# Altium schematic sheet 2_EVB-A32S1-M_MCU.SchDoc
size A4; SheetNumber: 2; SheetTotal: 4
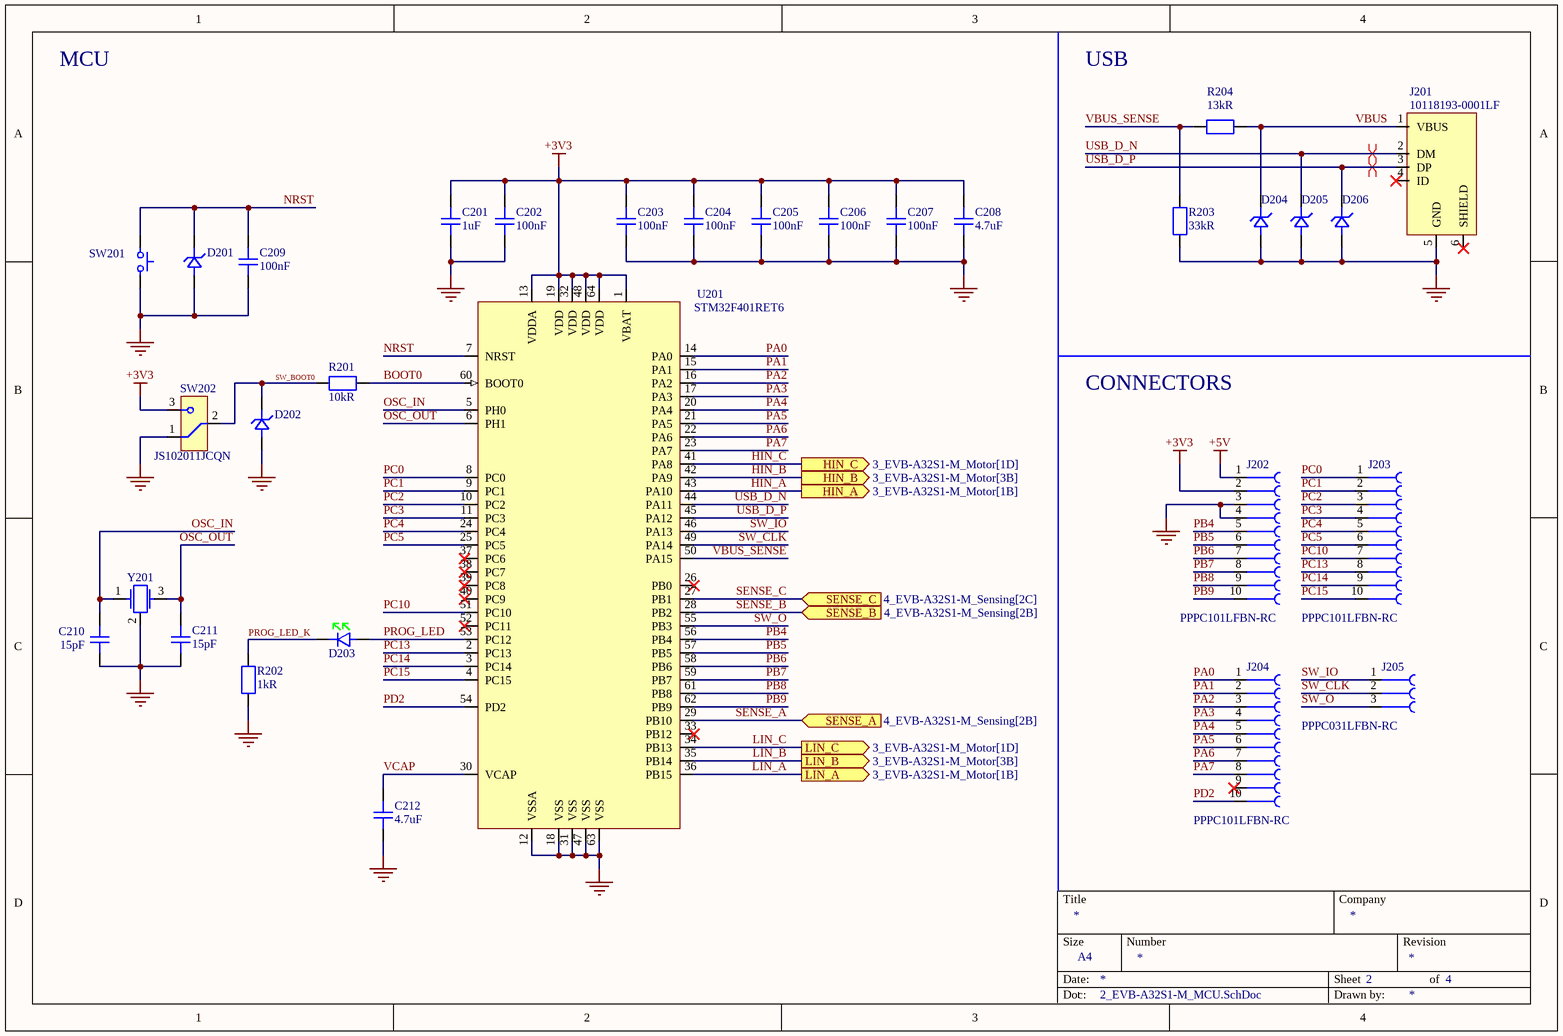
[diagram p0: 2_EVB-A32S1-M_MCU.SchDoc]

## Parts
C201  value 1uF  [C_Yageo_CC_0603_A]  (hidden comment: CC0603KRX7R7BB105)
C202  value 100nF  [C_Samsung_CL_0402_A]  (hidden comment: CL05B104KP5NNNC)
C203  value 100nF  [C_Samsung_CL_0402_A]  (hidden comment: CL05B104KP5NNNC)
C204  value 100nF  [C_Samsung_CL_0402_A]  (hidden comment: CL05B104KP5NNNC)
C205  value 100nF  [C_Samsung_CL_0402_A]  (hidden comment: CL05B104KP5NNNC)
C206  value 100nF  [C_Samsung_CL_0402_A]  (hidden comment: CL05B104KP5NNNC)
C207  value 100nF  [C_Samsung_CL_0402_A]  (hidden comment: CL05B104KP5NNNC)
C208  value 4.7uF  [C_Samsung_CL_0402_A]  (hidden comment: CL05A475MP5NRNC)
C209  value 100nF  [C_Samsung_CL_0402_A]  (hidden comment: CL05B104KP5NNNC)
C210  value 15pF  [C_Yageo_CC_0402_A]  (hidden comment: CC0402JRNPO9BN150)
C211  value 15pF  [C_Yageo_CC_0402_A]  (hidden comment: CC0402JRNPO9BN150)
C212  value 4.7uF  [C_Samsung_CL_0402_A]  (hidden comment: CL05A475MP5NRNC)
D201  D5V0F1U2S9-7  [D_TVS_Uni_Diodes_SOD-923_B]  (value not drawn)
D202  D5V0F1U2S9-7  [D_TVS_Uni_Diodes_SOD-923_B]  (value not drawn)
D203  LTST-C190GKT  [D_LED_Lite-On_Green_0603_A]  (value not drawn)
D204  D5V0F1U2S9-7  [D_TVS_Uni_Diodes_SOD-923_B]  (value not drawn)
D205  D5V0F1U2S9-7  [D_TVS_Uni_Diodes_SOD-923_B]  (value not drawn)
D206  D5V0F1U2S9-7  [D_TVS_Uni_Diodes_SOD-923_B]  (value not drawn)
J201  10118193-0001LF  [J_USB_Micro-B_Amphenol_10118193-0001LF]
J202  PPPC101LFBN-RC  [J_Sullins_01x10_Socket_2.54mm]
J203  PPPC101LFBN-RC  [J_Sullins_01x10_Socket_2.54mm]
J204  PPPC101LFBN-RC  [J_Sullins_01x10_Socket_2.54mm]
J205  PPPC031LFBN-RC  [J_Sullins_01x03_Socket_2.54mm]
R201  value 10kR  [R_Yageo_RCL_0402_A]  (hidden comment: RC0402FR-0710KL)
R202  value 1kR  [R_Yageo_RCL_0402_A]  (hidden comment: RC0402FR-071KL)
R203  value 33kR  [R_Yageo_RCL_0402_A]  (hidden comment: RC0402FR-0733KL)
R204  value 13kR  [R_Yageo_RCL_0402_A]  (hidden comment: RC0402FR-0713KL)
SW201  PTS647SN50SMTR2LFS  [SW_Tactitle_SPST_C&K_PTS647SN50SMTR2LFS]  (value not drawn)
SW202  JS102011JCQN  [SW_Slide_C&K_JS102011JCQN]
U201  STM32F401RET6  [U_ST_LQFP64_B]
Y201  ECS-240-12-37B-CKY-TR  [Y_Crystal_GND24_ECS_240-12-37B-CKY-TR]  (value not drawn)

## Ports
HIN_A (out, see 3_EVB-A32S1-M_Motor[1B]), HIN_B (out, see 3_EVB-A32S1-M_Motor[3B]), HIN_C (out, see 3_EVB-A32S1-M_Motor[1D]), LIN_A (out, see 3_EVB-A32S1-M_Motor[1B]), LIN_B (out, see 3_EVB-A32S1-M_Motor[3B]), LIN_C (out, see 3_EVB-A32S1-M_Motor[1D]), SENSE_A (in, see 4_EVB-A32S1-M_Sensing[2B]), SENSE_B (in, see 4_EVB-A32S1-M_Sensing[2B]), SENSE_C (in, see 4_EVB-A32S1-M_Sensing[2C])

## Nets
+3V3: C201.2 C202.2 C203.2 C204.2 C205.2 C206.2 C207.2 C208.2 J202.2 SW202.3 U201.1(VBAT) U201.13(VDDA) U201.19(VDD) U201.32(VDD) U201.48(VDD) U201.64(VDD)
+5V: J202.1
GND: C201.1 C202.1 C203.1 C204.1 C205.1 C206.1 C207.1 C208.1 C209.1 C210.1 C211.1 C212.1 D201.2 D202.2 D204.2 D205.2 D206.2 J201.5(GND) J202.3 J202.4 R202.1 R203.1 SW201.2 SW202.1 U201.12(VSSA) U201.18(VSS) U201.31(VSS) U201.47(VSS) U201.63(VSS) Y201.2
BOOT0: R201.2 U201.60(BOOT0)
HIN_A: U201.43(PA10) ; port HIN_A
HIN_B: U201.42(PA9) ; port HIN_B
HIN_C: U201.41(PA8) ; port HIN_C
LIN_A: U201.36(PB15) ; port LIN_A
LIN_B: U201.35(PB14) ; port LIN_B
LIN_C: U201.34(PB13) ; port LIN_C
NRST: C209.2 D201.1 SW201.1 U201.7(NRST)
OSC_IN: C210.2 U201.5(PH0) Y201.1
OSC_OUT: C211.2 U201.6(PH1) Y201.3
PA0: J204.1 U201.14(PA0)
PA1: J204.2 U201.15(PA1)
PA2: J204.3 U201.16(PA2)
PA3: J204.4 U201.17(PA3)
PA4: J204.5 U201.20(PA4)
PA5: J204.6 U201.21(PA5)
PA6: J204.7 U201.22(PA6)
PA7: J204.8 U201.23(PA7)
PB4: J202.5 U201.56(PB4)
PB5: J202.6 U201.57(PB5)
PB6: J202.7 U201.58(PB6)
PB7: J202.8 U201.59(PB7)
PB8: J202.9 U201.61(PB8)
PB9: J202.10 U201.62(PB9)
PC0: J203.1 U201.8(PC0)
PC1: J203.2 U201.9(PC1)
PC2: J203.3 U201.10(PC2)
PC3: J203.4 U201.11(PC3)
PC4: J203.5 U201.24(PC4)
PC5: J203.6 U201.25(PC5)
PC10: J203.7 U201.51(PC10)
PC13: J203.8 U201.2(PC13)
PC14: J203.9 U201.3(PC14)
PC15: J203.10 U201.4(PC15)
PD2: J204.10 U201.54(PD2)
PROG_LED: D203.2 U201.53(PC12)
PROG_LED_K: D203.1 R202.2
SENSE_A: U201.29(PB10) ; port SENSE_A
SENSE_B: U201.28(PB2) ; port SENSE_B
SENSE_C: U201.27(PB1) ; port SENSE_C
SW_BOOT0: D202.1 R201.1 SW202.2
SW_CLK: J205.2 U201.49(PA14)
SW_IO: J205.1 U201.46(PA13)
SW_O: J205.3 U201.55(PB3)
USB_D_N: D205.1 J201.2(DM) U201.44(PA11)
USB_D_P: D206.1 J201.3(DP) U201.45(PA12)
VBUS: D204.1 J201.1(VBUS) R204.2
VBUS_SENSE: R203.2 R204.1 U201.50(PA15)
VCAP: C212.2 U201.30(VCAP)

Not connected (* = marked no-connect by the designer): J201 4(ID)* 6(SHIELD)*; J204 9*; U201 26(PB0)* 33(PB12)* 37(PC6)* 38(PC7)* 39(PC8)* 40(PC9)* 52(PC11)*

## Layout directives
differential pair; differential pair class DIFF_USB: USB_D_N, USB_D_P

## Notes on the sheet
- MCU
- USB
- CONNECTORS
- Title
- Company
- Size
- Date:
- A4
- Number
- Sheet
- Revision
- of
- Doc:
- Drawn by:

## Library data of the parts
C201 = CMP-001-00019-5: Multilayer Ceramic Capacitor, 1 uF, 16 V, ± 10%, X7R, 0603 [1608 Metric]; Voltage: 16V; Dissipation Factor: 5%; Case Code (Imperial): 0603; ComponentLink1URL: https://www.yageo.com/upload/media/product/productsearch/datasheet/mlcc/UPY-GPHC_X7R_6.3V-to-250V_24.pdf; Pins: 2; Width: 0.031inch; Tolerance: 10%; Height: 0.8mm; Radiation Hardening: No; Lead Free: Lead Free; Material: Ceramic; Reach SVHC Compliant: Unknown; Case Code (Metric): 1608; Min Operating Temperature: -55°C; Case/Package: 0603; Package Quantity: 1; Thickness: 0.035inch; Packaging: Tape and Reel; Series: CC; Termination: SMD/SMT; Max Operating Temperature: 125°C; Construction: Flat; Depth: 0.8mm; Halogen Free: Halogen Free; RoHS Compliant: Yes; Voltage Rating (DC): 16V; Dielectric: X7R; Length: 1.6mm; Voltage Rating: 16V; Mounting Technology: Surface Mount; ComponentLink1Description: Datasheet
C202-C207 C209 = CMP-001-00023-3: Multilayer Ceramic Capacitor, 0.1 uF, 10 V, ± 10%, X7R, 0402 [1005 Metric]; Voltage Rating: 10V; Dielectric: X7R; Height: 0.5mm; Tolerance: 10%; Voltage Rating (DC): 10V; Case/Package: 0402; RoHS Compliant: Yes; Packaging: Tape and Reel; Case Code (Imperial): 0402; Material: Ceramic; Case Code (Metric): 1005; Max Operating Temperature: 125°C; Mounting Technology: Surface Mount; Min Operating Temperature: -55°C; Series: CL; Construction: Flat; Depth: 0.5mm; Length: 1mm; Package Quantity: 1; Radiation Hardening: No; Thickness: 0.022inch; Width: 0.02inch
C208 C212 = CMP-001-00024-3: Multilayer Ceramic Capacitor, 4.7 uF, 10 V, ± 20%, X5R, 0402 [1005 Metric]; Voltage Rating: 10V; Packaging: Cut Tape; Tolerance: 20%; Case Code (Metric): 1005; ComponentLink1Description: Datasheet; Mounting Technology: Surface Mount; ComponentLink1URL: https://mm.digikey.com/Volume0/opasdata/d220001/medias/docus/863/CL05A475MP5NRNC_Spec.pdf; Lead Free: Lead Free; Series: CL; Min Operating Temperature: -55°C; Material: Ceramic; Case Code (Imperial): 0402; Max Operating Temperature: 85°C; Dielectric: X5R; RoHS Compliant: Yes; Case/Package: 0402; Height: 550um
C210 C211 = CMP-001-00017-14: Multilayer Ceramic Capacitor, 15 pF, 10 V, ± 5%, X7R, 0402 [1005 Metric]; Insulation Resistance: 100GR; Dielectric: C0G; Voltage Rating (DC): 50V; Temperature Coefficient: 30ppm/°C; ComponentLink1URL: https://www.yageo.com/upload/media/product/productsearch/datasheet/mlcc/UPY-GP_NP0_16V-to-50V_18.pdf; Length: 1mm; Thickness: 0.022inch; Packaging: Tape and Reel; RoHS Compliant: Yes; Height: 0.5mm; Max Operating Temperature: 125°C; Depth: 0.5mm; Radiation Hardening: No; Termination: SMD/SMT; Width: 0.02inch; Series: CC; Tolerance: 5%; Lead Free: Lead Free; ComponentLink1Description: Datasheet; Package Quantity: 1; Min Operating Temperature: -55°C; Voltage: 50V; Case/Package: 0402; Reach SVHC Compliant: No; Case Code (Metric): 1005; Case Code (Imperial): 0402; Voltage Rating (AC): 50V; Mounting Technology: Surface Mount; Halogen Free: Halogen Free; Dielectric Material: Ceramic; Pins: 2; Voltage Rating: 50V; Material: Ceramic
D201 D202 D204-D206 = CMP-004-00007-2: Diode TVS Dual Uni-Dir 5.5V 250000W 2-Pin SOD-923 T/R; Max Power Dissipation: 250mW; ESD Protection: Yes; Max Reverse Leakage Current: 100nA; Max Surge Current: 1.5A; Diode Type: ZENER; Direction: Unidirectional; Breakdown Voltage: 6V; Clamping Voltage: 10V; Value: 5E-13F; Peak Pulse Power: 250kW; Number of Unidirectional Channels: 1; ComponentLink1Description: Datasheet; Working Voltage: 5.5V; Reverse Standoff Voltage: 5.5V; Case/Package: SOD-923-2; Max Operating Temperature: 150°C; Power Line Protection: Yes; Mounting Technology: Surface Mount; Peak Pulse Current: 1.5A; Packaging: Tape and Reel; RoHS Compliant: Yes; Package Quantity: 10000; Contact Plating: Tin,Matte; Series: -; Termination: SMD/SMT; Polarity: Unidirectional; Min Breakdown Voltage: 6V; Min Operating Temperature: -65°C; ComponentLink1URL: https://www.diodes.com/assets/Datasheets/D5V0F1U2S9.pdf
D203 = CMP-007-00001-3: LED Uni-Color Green 565nm 2-Pin Chip LED T/R; Viewing Angle: 130°; Lens Transparency: Clear; Reverse Voltage: 5V; Lens Size: 0.8mm; Lens Color: Colorless; Lens Style: Flat,Diffused,Colorless,Rectangular,Clear; Power Dissipation: 100mW; Forward Voltage: 2.1V; Dominant Wavelength: 569nm; Test Current: 10mA; Forward Current: 30mA; Luminous Intensity: 6mcd; Number of Elements: 1; Voltage: 2V; Series: -; ComponentLink1URL: https://mm.digikey.com/Volume0/opasdata/d220001/medias/docus/858/LTST-C190GKT.pdf; Packaging: Tape and Reel; Package Quantity: 1; Case Code (Imperial): 0603; Height: 0.9mm; ComponentLink1Description: Datasheet; Color: Green; Case Code (Metric): 1608; Min Operating Temperature: -55°C; Wavelength: 565nm; Length: 1.6mm; Max Operating Temperature: 85°C; Case/Package: 0603; RoHS Compliant: Yes; Mounting Technology: Surface Mount; Width: 0.8mm; Depth: 0.8mm; Illumination Color: Green; Lead Free: Lead Free; Number of LEDs: 1; Pins: 2; Power Rating: 100mW; Radiation Hardening: No
J201 = CMP-002-00002-12: Usb Connector, 5 Contact(S), Female, Right Angle, Surface Mount Terminal, Locking, Receptacle; Number of Contacts: 5; Current Rating: 1.8A; Connector Type: USB,Receptacle; Pitch: 650um; Number of Ports: 1; Voltage Rating: 100V; USB Standard: USB 2.0; Insulation Resistance: 1GR; Pins: 11; Termination: Solder; Height: 3mm; Packaging: Tape and Reel; Max Operating Temperature: 85°C; Radiation Hardening: No; Features: Shielded; Contact Material: Nickel,Gold; Series: -; Orientation: Right Angle; Min Operating Temperature: -55°C; ComponentLink2URL: https://cdn.amphenol-cs.com/media/wysiwyg/files/documentation/datasheet/inputoutput/io_usb_micro.pdf; Color: Black; Housing Material: Polymer; Mounting Technology: Surface Mount,Horizontal; ComponentLink1Description: Drawing; Depth: 5.67mm; Package Quantity: 1200; ComponentLink1URL: https://cdn.amphenol-cs.com/media/wysiwyg/files/drawing/10118193.pdf; ComponentLink2Description: Datasheet; Flammability Rating: UL94 V-0; Length: 7.86mm; Gender: Female; Contact Plating: Gold; Max Voltage Rating (AC): 100V
J202-J204 = CMP-002-00003-9: 10 Position Total Single Row 2.54 mm Pitch Straight Female Header; Voltage Rating: 250V; Number of Contacts: 10; Pitch: 0.1inch; Current Rating: 3A; Connector Type: Header; Number of Rows: 1; Package Quantity: 1000; Contact Type: Female Socket; Color: Black; Min Operating Temperature: -40°C; RoHS Compliant: Yes; Length: 25.9mm; ComponentLink1URL: https://mm.digikey.com/Volume0/opasdata/d220001/medias/docus/937/Female_Headers.100_DS.pdf; ComponentLink1Description: Datasheet; Height: 8.5mm; Contact Plating: Gold; Width: 2.5mm; Packaging: Bulk; Mounting Technology: Through Hole; Contact Material: Bronze,Nickel,Gold; Lead Free: Lead Free; Termination: Solder; Housing Material: Plastic; Number of Positions: 10; Max Operating Temperature: 105°C
J205 = CMP-002-00004-17: 3 Position Total Single Row 2.54 mm Pitch Straight Female Header; Voltage Rating: 250V; Number of Positions: 3; Pitch: 2.54mm; Series: -; Length: 8.12mm; Connector Type: Header; Insulation Color: Black; Insulation Material: Polyester; Height: 8.5mm; ComponentLink1Description: Datasheet; Termination: Solder; Contact Shape: Square; Width: 2.5mm; Fastening Type: Pull; RoHS Compliant: Yes; Contact Finish - Mating: GOLD; Number of Rows: 1; Min Operating Temperature: -40°C; Max Operating Temperature: 105°C; Flammability Rating: UL94 V-0; Contact Material: Bronze; Packaging: Tray; Contact Type: Female Socket; Lead Free: Lead Free; Mounting Technology: Through Hole; ComponentLink1URL: https://mm.digikey.com/Volume0/opasdata/d220001/medias/docus/937/Female_Headers.100_DS.pdf; Housing Material: Plastic
R201 = CMP-009-00003-11: SMD Chip Resistor, 10 kOhm, ± 1%, 62.5 mW, 0402 [1005 Metric], Thick Film, General Purpose; Power Rating: 62.5mW; Max Power Dissipation: 63mW; Temperature Coefficient: 100ppm/°C; Voltage Rating (DC): 50V; Number of Terminations: 2; Width: 0.5mm; Resistance Tolerance: 1%; Length: 1mm; Lead Pitch: 0.2mm; Case Code (Metric): 1005; Case Code (Imperial): 0402; Construction: Rectangular; Tolerance: 1%; ComponentLink1URL: https://www.yageo.com/upload/media/product/products/datasheet/rchip/PYu-RC_Group_51_RoHS_L_12.pdf; Max Operating Temperature: 155°C; Series: RC; Military Standard: Not; Depth: 0.5mm; ComponentLink1Description: Datasheet; Features: Moisture Resistant; Termination: SMD/SMT; Pins: 2; Lead Free: Lead Free; Min Operating Temperature: -55°C; Resistor Type: Thick Film; Voltage Rating: 50V; Case/Package: 0402; Packaging: Tape and Reel; RoHS Compliant: Yes; Reach SVHC Compliant: Unknown
R202 = CMP-009-00002-11: SMD Chip Resistor, 1 kOhm, ± 1%, 62.5 mW, 0402 [1005 Metric], Thick Film, General Purpose; Temperature Coefficient: 100ppm/°C; Max Power Dissipation: 63mW; Voltage Rating (AC): 50V; Power Rating: 62.5mW; Min Operating Temperature: -55°C; Case Code (Metric): 1005; Number of Terminations: 2; Case Code (Imperial): 0402; Pins: 2; Depth: 0.5mm; Construction: Rectangular; Voltage Rating: 50V; RoHS Compliant: Yes; Series: RC; Resistor Type: Thick Film; Length: 1mm; Voltage Rating (DC): 50V; Case/Package: 0402; Features: Moisture Resistant; Reach SVHC Compliant: No; Lead Free: Lead Free; Termination: SMD/SMT; Height: 0.32mm; Tolerance: 1%; ComponentLink1Description: Datasheet; Packaging: Tape and Reel; Width: 0.5mm; Resistance Tolerance: 1%; Military Standard: Not; ComponentLink1URL: https://www.yageo.com/upload/media/product/products/datasheet/rchip/PYu-RC_Group_51_RoHS_L_12.pdf; Max Operating Temperature: 155°C; Technology: THICK FILM
R203 = CMP-009-00005-12: SMD Chip Resistor, 33 kOhm, ± 1%, 63 mW, 0402 [1005 Metric], Thick Film, General Purpose; Power Rating: 63mW; Temperature Coefficient: 100ppm/°C; Voltage Rating (AC): 50V; Tolerance: 1%; Military Standard: Not; Features: Moisture Resistant; RoHS Compliant: Yes; Construction: Rectangular; Number of Terminations: 2; Min Operating Temperature: -55°C; Case Code (Metric): 1005; Resistor Type: Thick Film; Max Power Dissipation: 63mW; Voltage Rating (DC): 50V; Pins: 2; Series: RC; Termination: SMD/SMT; ComponentLink1Description: Datasheet; Max Operating Temperature: 155°C; Case/Package: 0402; Reach SVHC Compliant: No; Case Code (Imperial): 0402; Height: 0.016inch; Depth: 0.5mm; Length: 1mm; Package Quantity: 1; Lead Free: Lead Free; Resistance Tolerance: 1%; Weight: 2.3E-05oz; Width: 0.5mm; Packaging: Tape and Reel; Voltage Rating: 50V; ComponentLink1URL: https://www.yageo.com/upload/media/product/products/datasheet/rchip/PYu-RC_Group_51_RoHS_L_12.pdf
R204 = CMP-009-00001-11: SMD Chip Resistor, 13 kOhm, ± 1%, 63 mW, 0402 [1005 Metric], Thick Film, General Purpose; Voltage Rating (DC): 50V; Temperature Coefficient: 100ppm/°C; Max Power Dissipation: 63mW; Power Rating: 62.5mW; Package Quantity: 10000; Packaging: Tape and Reel; Max Operating Temperature: 155°C; Termination: SMD/SMT; Mounting Technology: Surface Mount; Min Operating Temperature: -55°C; Series: RC; Width: 0.02inch; Lead Free: Lead Free; Case Code (Metric): 1005; Tolerance: 1%; Working Voltage: 50V; Voltage Rating: 50V; ComponentLink1URL: https://www.yageo.com/upload/media/product/products/datasheet/rchip/PYu-RC_Group_51_RoHS_L_12.pdf; Case/Package: 0402; Length: 0.039inch; Height: 0.016inch; ComponentLink1Description: Datasheet; Technology: THICK FILM; Depth: 0.5mm; RoHS Compliant: Yes; Features: Moisture Resistant; Case Code (Imperial): 0402; Number of Terminations: 2
SW201 = CMP-011-00000-13: Switch Tactile N.O. SPST Round Button Gull Wing 0.05A 12VDC 100000Cycles 0.98N SMD T/R; pin to pad: 1>1+2 2>3+4; Ratings: IP40; Switch Function: Off-Mom; Illumination Type: Non-Illuminated; Actuator Type: Standard; Number of Positions: 2; Operating Force: 100gf; Switch Travel: 0.25mm; ComponentLink1URL: https://www.ckswitches.com/media/2567/pts647.pdf; Series: PTS647; Throw Configuration: SPST; Max Operating Temperature: 70°C; Mechanical Life: 100000Cycles; Min Operating Temperature: -20°C; Packaging: Cut Tape; Mounting Technology: Surface Mount; ComponentLink1Description: Datasheet; Termination: Gull Wing
SW202 = CMP-011-00001-10: JS Series Sub-Miniature Slide Switch SPDT On-On Top Slide 0.3A 6VDC J-Lead Surface Mount T/R; Voltage Rating (DC): 6V; Switch Travel: 2mm; Actuator Material: Nylon,Polyamide,PA46; Electrical Life: 5000Cycles; Actuator Type: Standard; Max Operating Temperature: 85°C; ComponentLink1Description: Datasheet; Mounting Technology: Surface Mount; ComponentLink1URL: https://www.ckswitches.com/media/1422/js.pdf; Actuator Length: 2mm; Packaging: Cut Tape; Contact Plating: Silver; Contact Material: Copper Alloy; Min Operating Temperature: -40°C; Throw Configuration: SPDT; Switch Function: On-On; Series: JS
U201 = CMP-020-00000-16: MCU 32-bit STM32 ARM Cortex M4 RISC 512KB Flash 1.8V/2.5V/3.3V 64-Pin LQFP Tray; Operating Supply Voltage: 3.3V; Peripherals: Brown-out Detect/Reset,POR,PWM,WDT,DMA; Nominal Supply Current: 1.8uA; Number of ADC Channels: 12; Interface: I2C,SPI,USB,IrDA,SDIO,UART,USART,LIN,I2S; Clock Frequency: 84MHz; Number of USB Channels: 1; Number of Timers/Counters: 8; Number of Channels: 16; Number of PWM Channels: 23; Number of UART Channels: 3; Number of Programmable I/O: 50; Watchdog Timer: Yes; Max Power Dissipation: 313mW; Min Supply Voltage: 1.7V; Data Bus Width: 32b; RAM Size: 96KB; Max Supply Voltage: 3.6V; Oscillator Type: Internal; ComponentLink1Description: Datasheet; Memory Format: FLASH; Memory Size: 512KB; Case/Package: LQFP; Core Architecture: ARM; Pins: 64; ComponentLink1URL: https://www.st.com/content/ccc/resource/technical/document/datasheet/30/91/86/2d/db/94/4a/d6/DM00102166.pdf/files/DM00102166.pdf/jcr:content/translations/en.DM00102166.pdf; Height: 1.6mm; Series: STM32 F4; Packaging: Tray; Reach SVHC Compliant: No; RoHS Compliant: Yes; Number of I/Os: 50; Frequency: 84MHz; Max Operating Temperature: 85°C; Min Operating Temperature: -40°C; Weight: 0.012088oz; Number of I2C Channels: 3; Package Quantity: 960; Number of SPI Channels: 3; Number of A/D Converters: 1; Radiation Hardening: No; Lead Free: Lead Free
Y201 = CMP-003-00000-11: Crystal 24MHz ±10ppm (Tol) ±10ppm (Stability) 12pF FUND 50Ohm 4-Pin Mini-CSMD T/R; pin to pad: 2>2+4; Case/Package: 4-SMD, No Lead; Frequency: 24MHz; Size: 0.079" L x 0.063" W (2.00mm x 1.60mm); Load Capacitance: 12pF; ComponentLink1Description: Datasheet; ComponentLink1URL: https://ecsxtal.com/store/pdf/ECX-1637B.pdf